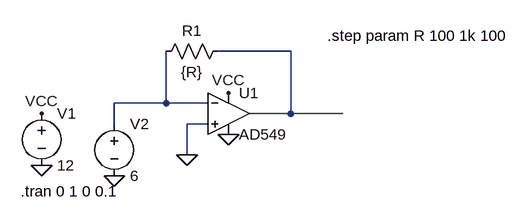
[diagram p0: schematic Regulador_DC_1.asc]
Regulador_DC_1.asc, the LTspice schematic file:
Version 4.1
SHEET 1 880 680
WIRE 320 96 208 96
WIRE 128 176 128 96
WIRE 128 176 48 176
WIRE 192 176 128 176
WIRE 320 192 320 96
WIRE 320 192 256 192
WIRE 400 192 320 192
WIRE 48 208 48 176
WIRE 192 208 160 208
WIRE 160 256 160 208
FLAG 224 224 0
FLAG -64 192 VCC
FLAG -64 272 0
FLAG 224 160 VCC
FLAG 160 256 0
FLAG 48 288 0
SYMBOL OpAmps\\AD549 224 128 R0
SYMATTR InstName U1
SYMBOL voltage -64 176 R0
WINDOW 123 0 0 Left 0
WINDOW 39 0 0 Left 0
SYMATTR InstName V1
SYMATTR Value 12
SYMBOL res 224 80 R90
WINDOW 0 0 56 VBottom 2
WINDOW 3 32 56 VTop 2
SYMATTR InstName R1
SYMATTR Value {R}
SYMBOL voltage 48 192 R0
WINDOW 123 0 0 Left 0
WINDOW 39 0 0 Left 0
SYMATTR InstName V2
SYMATTR Value 6
TEXT 376 72 Left 2 !.step param R 100 1k 100
TEXT -96 312 Left 2 !.tran 0 1 0 0.1

The netlist it stands for:
* Regulador_DC_1.asc
X§U1 0 N002 VCC 0 N001 AD549  ; pins In+ In- V+ V- OUT
V1 VCC 0 12
R1 N001 N002 {R}
V2 N002 0 6
.step param R 100 1k 100
.tran 0 1 0 0.1
.backanno
.end